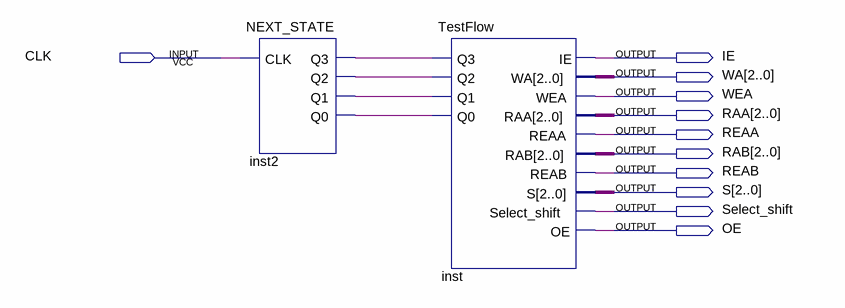
[diagram p0: schematic sheet]
// Quartus schematic Final_Controller.bdf as structural Verilog: 2 symbols, 11 pins
module Final_Controller (
  input  CLK,
  output IE,
  output [2:0] WA,
  output WEA,
  output [2:0] RAA,
  output REAA,
  output [2:0] RAB,
  output REAB,
  output [2:0] S,
  output Select_shift,
  output OE
);

  wire inst2_q0, inst2_q1, inst2_q2, inst2_q3;

  NEXT_STATE inst2 (.CLK(CLK), .Q3(inst2_q3), .Q2(inst2_q2), .Q1(inst2_q1), .Q0(inst2_q0));
  TestFlow inst (
    .Q3(inst2_q3), .Q2(inst2_q2), .Q1(inst2_q1), .Q0(inst2_q0), .IE(IE), .WA(WA), .WEA(WEA), .RAA(RAA),
    .REAA(REAA), .RAB(RAB), .REAB(REAB), .S(S), .Select_shift(Select_shift), .OE(OE));
endmodule
